# EAGLE schematic list13 (EAGLE 7.5.0)
ESKD_CHECKED: 209|224|244|232|243|235|235|232|237|32|205|46|210; ESKD_CONTROLN: 202|238|247|234|232|237|224|32|194|46|212; ESKD_COPYRIGHT: 211|240|212|211|44|32|200|208|200|210|45|208|210|212|44|32|208|199|45|54|48|48|52|48|55; ESKD_DATE1: 50|53|46|48|53|46|50|48|49|54; ESKD_DESCRIPTION1: 192|239|239|224|240|224|242|237|238|45|239|240|238|227|240|224|236|236|237|251|233|32|234|238|236|239|235|229|234|241|32|228|235|255|32|238|239|229|240|224|242|232|226|237|238|227|238|32|236|238|237|232|242|238|240|232|237|227|224|32|234|224|247|229|241|242|226|224|32|226|238|231|228|243|245|224|32|226|32|230|232|235|251|245|32|239|238|236|229|249|229|237|232|255|245; ESKD_DESCRIPTION2: 241|245|229|236|224|32|253|235|229|234|242|240|232|247|229|241|234|224|255; ESKD_DESCRIPTION3: 239|240|232|237|246|232|239|232|224|235|252|237|224|255; ESKD_ENGINEER: 208|238|227|238|230|232|237|32|194|46|200|46; ESKD_NUMBER: 50|51|48|50|48|49|32|48|48|48|32|48|48|48|32|55|49|55; ESKD_ORIENTATION: 48; ESKD_PAPER_SIZE: 49; ESKD_SHEETS: 49
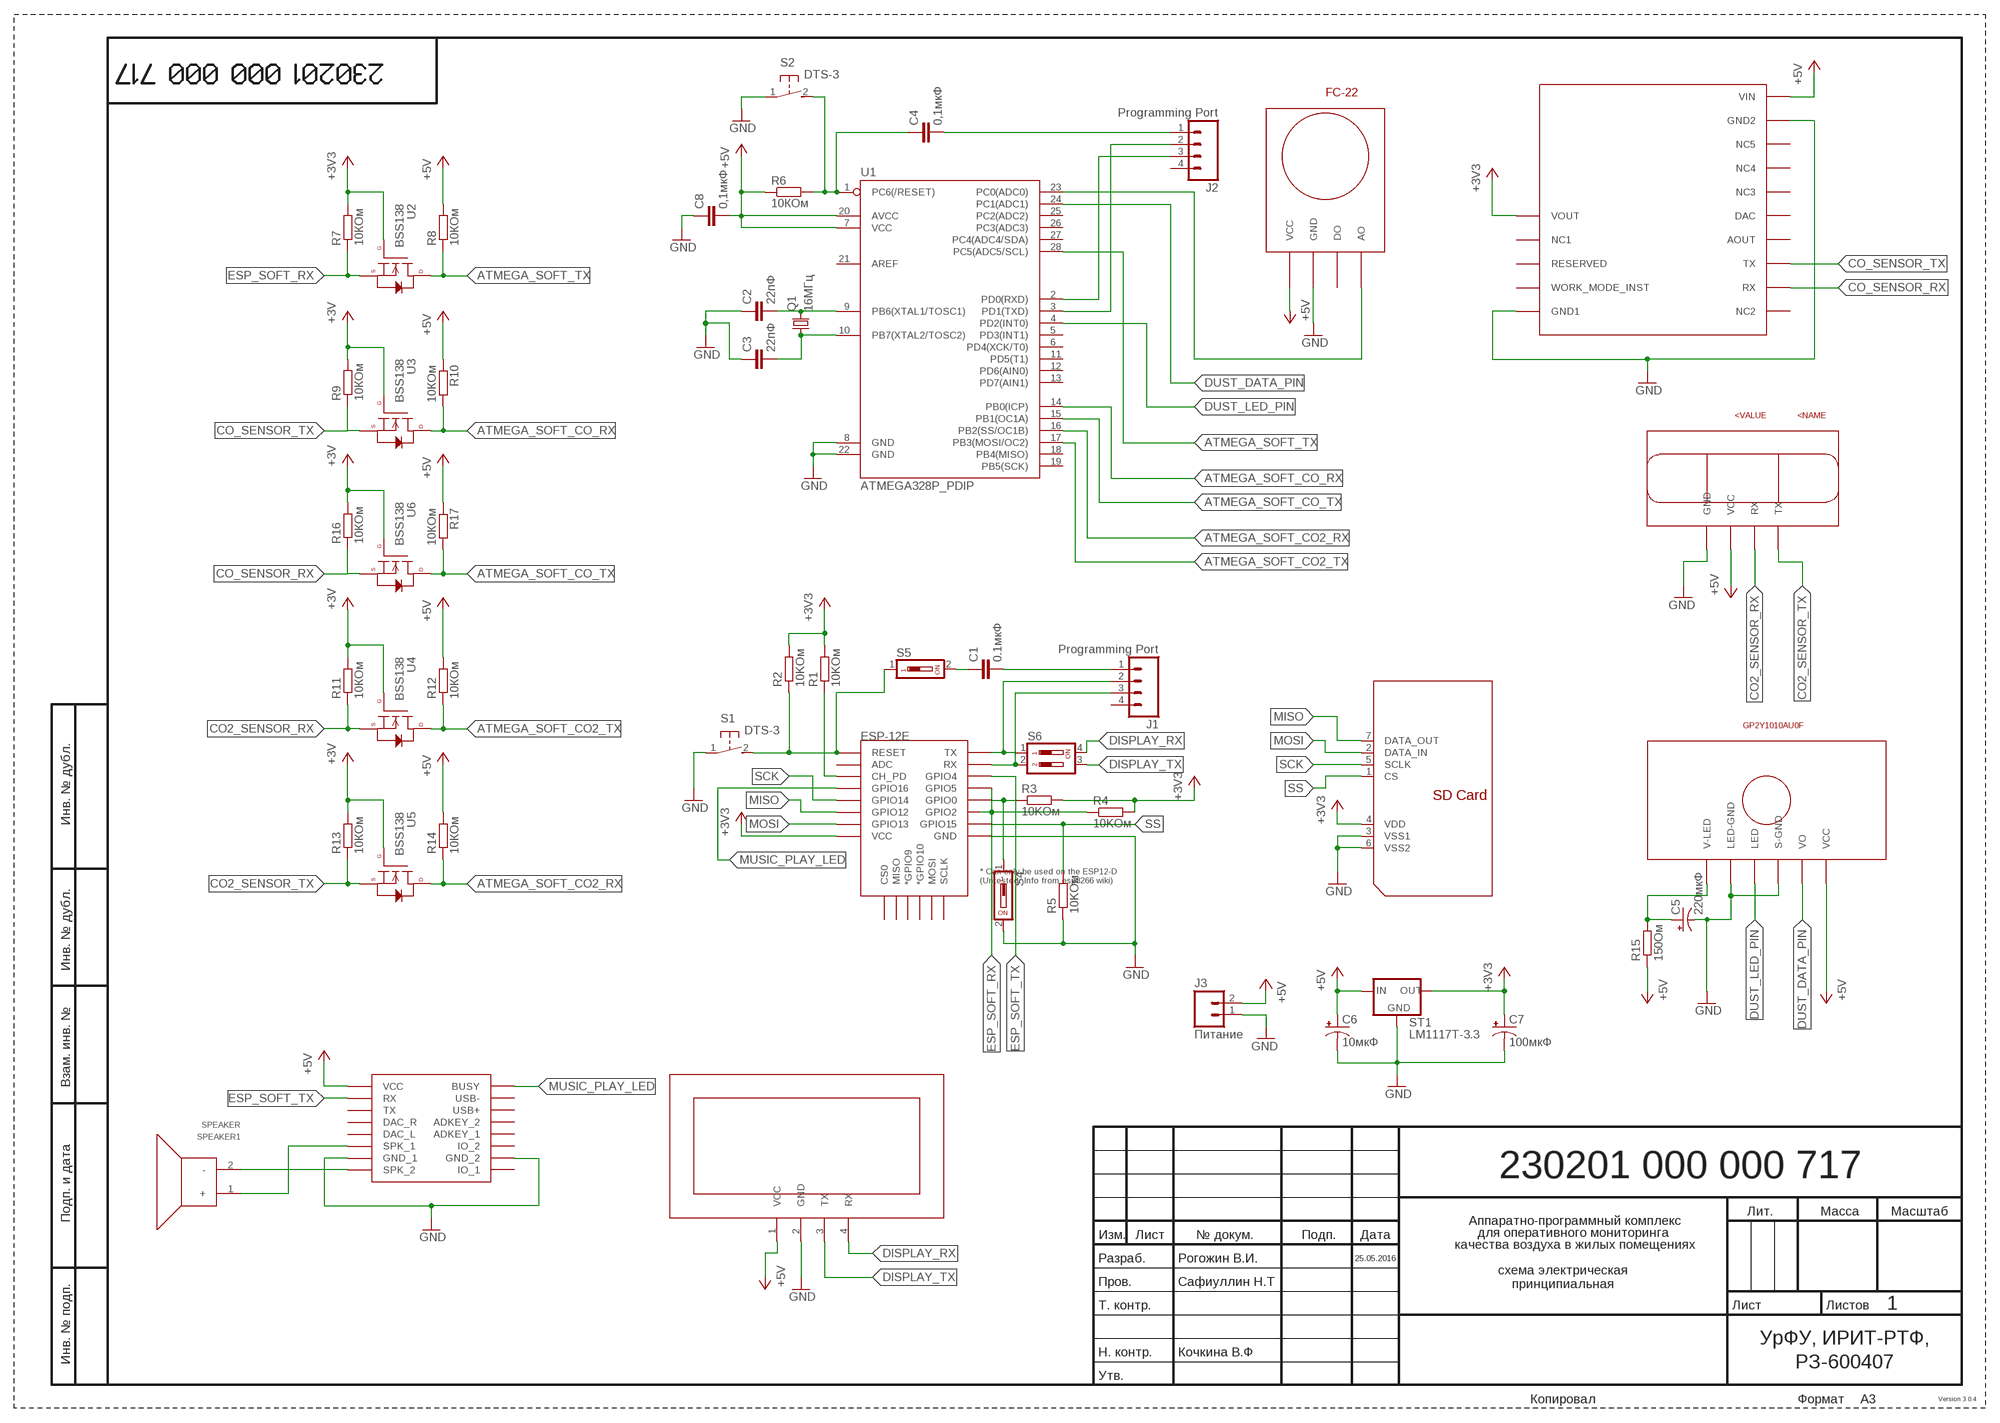
[diagram p0: schematic, sheet 1]

## Parts
C1  0.1мкФ  0.1UF-50V-20%(PTH)KIT-EZ  [CAP-PTH-SMALL-KIT]
C2  22пФ  0.1UF-50V-20%(PTH)KIT-EZ  [CAP-PTH-SMALL-KIT]
C3  22пФ  0.1UF-50V-20%(PTH)KIT-EZ  [CAP-PTH-SMALL-KIT]
C4  0,1мкФ  0.1UF-50V-20%(PTH)KIT-EZ  [CAP-PTH-SMALL-KIT]
C5  220мкФ  10UF-25V-20%(PTH)KIT  [CPOL-RADIAL-10UF-25V-KIT]
C6  10мкФ  10UF-25V-20%(PTH)KIT  [CPOL-RADIAL-10UF-25V-KIT]
C7  100мкФ  10UF-25V-20%(PTH)KIT  [CPOL-RADIAL-10UF-25V-KIT]
C8  0,1мкФ  0.1UF-50V-20%(PTH)KIT-EZ  [CAP-PTH-SMALL-KIT]
ESP-12E  ESP12ESMD  [ESP12E-SMD]
FC-22  FC-22FC-22-STANDART  [FC-22]
GP2Y1010AU0F  GP2Y1010AU0FGP2Y1010AU0F  [1X06]
J1  Programming Port  M04PTH  [1X04]
J2  Programming Port  M04PTH  [1X04]
J3  Питание  M02PTH  [1X02]
MH-Z14  MH-Z14  [1X04]
NEXTION1  NEXTION  [1X04]
Q1  16МГц  CRYSTALHC33U-V  [HC33U-V]
R1  10KОм  R-EU_0207/10  [0207/10]
R2  10KОм  R-EU_0207/10  [0207/10]
R3  10KОм  R-EU_0207/10  [0207/10]
R4  10KОм  R-EU_0207/10  [0207/10]
R5  10KОм  R-EU_0207/10  [0207/10]
R6  10КОм  R-EU_0207/10  [0207/10]
R7  10КОм  R-EU_0207/10  [0207/10]
R8  10КОм  R-EU_0207/10  [0207/10]
R9  10КОм  R-EU_0207/10  [0207/10]
R10  10КОм  R-EU_0207/10  [0207/10]
R11  10КОм  R-EU_0207/10  [0207/10]
R12  10КОм  R-EU_0207/10  [0207/10]
R13  10КОм  R-EU_0207/10  [0207/10]
R14  10КОм  R-EU_0207/10  [0207/10]
R15  150Ом  R-EU_0207/10  [0207/10]
R16  10КОм  R-EU_0207/10  [0207/10]
R17  10КОм  R-EU_0207/10  [0207/10]
S1  DTS-3  [DTS-3]
S2  DTS-3  [DTS-3]
S4  DS01  [DS-01]
S5  DS01  [DS-01]
S6  DS02  [DS-02]
SDCARD-1  SDCARDSDSTAY  [SD]
SPEAKER1  SPEAKER  [1X02]
ST1  LM1117T-3.3  V_REG_LD1117VXX  [78XXL]
U1  ATMEGA328P_PDIP  [DIL28-3]
U2  BSS138  N-CHANNEL-MOSFET-BSS138  [SOT23-3]
U3  BSS138  N-CHANNEL-MOSFET-BSS138  [SOT23-3]
U4  BSS138  N-CHANNEL-MOSFET-BSS138  [SOT23-3]
U5  BSS138  N-CHANNEL-MOSFET-BSS138  [SOT23-3]
U6  BSS138  N-CHANNEL-MOSFET-BSS138  [SOT23-3]
U$1  DFPLAYER  [DFPLAYER]
Z07-CO-1  ZE07-CO  [Z07-CO]

## Nets
+3V3: C7.1(+) ESP-12E.VCC R1.2 R2.2 R3.2 R4.2 R7.2 ST1.GND(OUT) U2.1(G) Z07-CO-1.1(VOUT)
+5V: C6.1(+) C8.2 FC-22.1(VCC) GP2Y1010AU0F.6(VCC) J3.2 MH-Z14.3(VCC) NEXTION1.1(VCC) R6.1 R10.1 R12.2 R14.2 R15.1 R17.1 ST1.OUT(IN) U1.7(VCC) U1.20(AVCC) U$1.VCC Z07-CO-1.15(VIN)
ATMEGA_SOFT_CO2_RX: R14.1 U1.16(PB2(SS/OC1B)) U5.3(D)
ATMEGA_SOFT_CO2_TX: R12.1 U1.17(PB3(MOSI/OC2)) U4.3(D)
ATMEGA_SOFT_CO_RX: R10.2 U1.14(PB0(ICP)) U3.3(D)
ATMEGA_SOFT_CO_TX: R17.2 U1.15(PB1(OC1A)) U6.3(D)
ATMEGA_SOFT_TX: R8.1 U1.28(PC5(ADC5/SCL)) U2.3(D)
CO2_SENSOR_RX: MH-Z14.2(RX) R11.1 U4.2(S)
CO2_SENSOR_TX: MH-Z14.1(TX) R13.1 U5.2(S)
CO_SENSOR_RX: R16.1 U6.2(S) Z07-CO-1.7(RX)
CO_SENSOR_TX: R9.1 U3.2(S) Z07-CO-1.8(TX)
DISPLAY_RX: NEXTION1.4(RX) S6.4
DISPLAY_TX: NEXTION1.3(TX) S6.3
DUST_DATA_PIN: GP2Y1010AU0F.5(VO) U1.24(PC1(ADC1))
DUST_LED_PIN: GP2Y1010AU0F.3(LED) U1.4(PD2(INT0))
ESP_SOFT_RX: ESP-12E.GPIO5 R7.1 U2.2(S)
ESP_SOFT_TX: ESP-12E.GPIO4 U$1.RX
GND: C2.1 C3.1 C5.2(-) C6.2(-) C7.2(-) C8.1 ESP-12E.GND FC-22.2(GND) GP2Y1010AU0F.2(LED-GND) GP2Y1010AU0F.4(S-GND) J3.1 MH-Z14.4(GND) NEXTION1.2(GND) R5.1 S1.1 S2.1 S4.2 ST1.IN(GND) U1.8(GND) U1.22(GND) U$1.GND_1 U$1.GND_2 Z07-CO-1.5(GND1) Z07-CO-1.14(GND2)
MISO: ESP-12E.GPIO12 SDCARD-1.7(DATA_OUT)
MOSI: ESP-12E.GPIO13 SDCARD-1.2(DATA_IN)
MUSIC_PLAY_LED: ESP-12E.GPIO16 U$1.BUSY
N$1: C5.1(+) GP2Y1010AU0F.1(V-LED) R15.2
N$2: ESP-12E.RESET R2.1 S1.2 S5.1
N$3: ESP-12E.CH_PD R1.1
N$4: ESP-12E.GPIO0 R3.1 S4.1
N$5: ESP-12E.GPIO2 R4.1
N$6: ESP-12E.RXD0(RX) J1.3 S6.2
N$7: C1.1 S5.2
N$8: C1.2 J1.1
N$9: ESP-12E.TXD0(TX) J1.2 S6.1
N$10: C3.2 Q1.1 U1.10(PB7(XTAL2/TOSC2))
N$11: SPEAKER1.1(+) U$1.SPK1(SPK_1)
N$12: SPEAKER1.2(-) U$1.SPK2(SPK_2)
N$13: C2.2 Q1.2 U1.9(PB6(XTAL1/TOSC1))
N$14: C4.2 J2.1
N$15: J2.2 U1.3(PD1(TXD))
N$16: C4.1 R6.2 S2.2 U1.1(PC6(/RESET))
N$17: J2.3 U1.2(PD0(RXD))
N$18: FC-22.4(AO) U1.23(PC0(ADC0))
N$22: R8.2 ; supply symbol labelled +5V
SCK: ESP-12E.GPIO14 SDCARD-1.5(SCLK)
SS: ESP-12E.GPIO15 R5.2 SDCARD-1.1(CS)
VCC: R9.2 R11.2 R13.2 R16.2 U3.1(G) U4.1(G) U5.1(G) U6.1(G) ; supply symbol labelled +3V
VDD: SDCARD-1.4(VDD) ; supply symbol labelled +3V3
VSS2: SDCARD-1.3(VSS1) SDCARD-1.6(VSS2) ; supply symbol labelled GND
Unconnected: ESP-12E.ADC ESP-12E.CS0 ESP-12E.GPIO9(*GPIO9) ESP-12E.GPIO10(*GPIO10) ESP-12E.MISO ESP-12E.MOSI ESP-12E.SCLK FC-22.3(DO) J1.4 J2.4 U1.5(PD3(INT1)) U1.6(PD4(XCK/T0)) U1.11(PD5(T1)) U1.12(PD6(AIN0)) U1.13(PD7(AIN1)) U1.18(PB4(MISO)) U1.19(PB5(SCK)) U1.21(AREF) U1.25(PC2(ADC2)) U1.26(PC3(ADC3)) U1.27(PC4(ADC4/SDA)) U$1.ADKEY1(ADKEY_1) U$1.ADKEY2(ADKEY_2) U$1.DAC_L U$1.DAC_R U$1.IO1(IO_1) U$1.IO2(IO_2) U$1.TX U$1.USB+ U$1.USB- Z07-CO-1.2(NC1) Z07-CO-1.3(RESERVED) Z07-CO-1.4(WORK_MODE_INST) Z07-CO-1.6(NC2) Z07-CO-1.9(AOUT) Z07-CO-1.10(DAC) Z07-CO-1.11(NC3) Z07-CO-1.12(NC4) Z07-CO-1.13(NC5)

## Notes on the sheet
- Инв. № дубл.
- Инв. № дубл.
- Взам. инв. №
- 230201 000 000 717
- Подп. и дата
- Лит. | Масса | Масштаб
- Аппаратно-программный комплекс
- для оперативного мониторинга
- Изм. | Лиcт | № докум. | Подп. | Дата
- качества воздуха в жилых помещениях
- 25.05.2016
- Разраб. | Рогожин В.И.
- схема электрическая
- Пров. | Сафиуллин Н.Т | принципиальная
- Т. контр. | Лиcт | Листов | 1
- Инв. № подп.
- УрФУ, ИРИТ-РТФ,
- Н. контр. | Кочкина В.Ф
- РЗ-600407
- Утв.
- Копировал | Формат | A3 | Version 3.0.4

## Library data of the parts
C1-C4 C8 = SparkFun-Capacitors:0.1UF-50V-20%(PTH): CAP-08370; PROD_ID: CAP-08370
C5-C7 = SparkFun-Capacitors:10UF-25V-20%(PTH): CAP-08440; PROD_ID: CAP-08440
ESP-12E = esp8266modules:ESP12E: ESP12E Module
FC-22 = diplom:FC-22
GP2Y1010AU0F = diplom:GP2Y1010AU0F
J1 J2 = SparkFun-Connectors:M04: Header 4 Standard 4-pin 0.1" header. Use with straight break away headers (SKU : PRT-00116), right angle break away headers (PRT-00553), swiss pins (PRT-00743), machine pins (PRT-00117), and female headers (PRT-00115). Molex polarized connector foot print use with SKU : PRT-08231 with associated crimp pins and housings. 1MM SMD Version SKU: PRT-10208; PROD_ID: CONN-09696
J3 = SparkFun-Connectors:M02: Standard 2-pin 0.1" header. Use with - straight break away headers ( PRT-00116) - right angle break away headers (PRT-00553) - swiss pins (PRT-00743) - machine pins (PRT-00117) - female headers (PRT-00115) Molex polarized connector foot print use with: PRT-08233 with associated crimp pins and housings. 2.54_SCREWTERM for use with PRT-10571. 3.5mm Screw Terminal footprints for PRT-08084 5mm Screw Terminal footprints for use with PRT-08432
MH-Z14 = diplom:MH-Z14
NEXTION1 = diplom:NEXTION
Q1 = crystal:CRYSTAL: CRYSTAL; OC_FARNELL: unknown; OC_NEWARK: unknown
R1-R17 = rcl:R-EU_: RESISTOR, European symbol
S1 S2 = switch-tact:DTS-3
S4 S5 = switch-dil:DS01: DIL/CODE SWITCH; OC_FARNELL: unknown; OC_NEWARK: unknown
S6 = switch-dil:DS02: DIL/CODE SWITCH; OC_FARNELL: 9472126; OC_NEWARK: unknown
SDCARD-1 = diplom:SDCARD
SPEAKER1 = diplom:SPEAKER
ST1 = SparkFun-PowerIC:V_REG_LD1117VXX: LD1117VXX voltage regulator. We carry the 3.3V version (COM-00526) in TO-220 package.
U1 = SparkFun-DigitalIC:ATMEGA328P_PDIP: uC used in the Arduino 32kb flash, 1k EEPROM, 2k SRAM This is the through-hole version of this chip.
U2-U6 = GeekAmmo:N-CHANNEL-MOSFET: N-Channel MOSFET Mode Field Effect Transistor; DATASHEET: http://www.fairchildsemi.com/ds/BS/BSS138.pdf; DIGIKEY: BSS138TR-ND; ELEMENT14: 2323154; URL: http://au.element14.com/fairchild-semiconductor/bss138/mosfet-n-ch-50v-220ma-sot-23/dp/2323154
U$1 = DFPlayer_v1:DFPLAYER
Z07-CO-1 = diplom:ZE07-CO